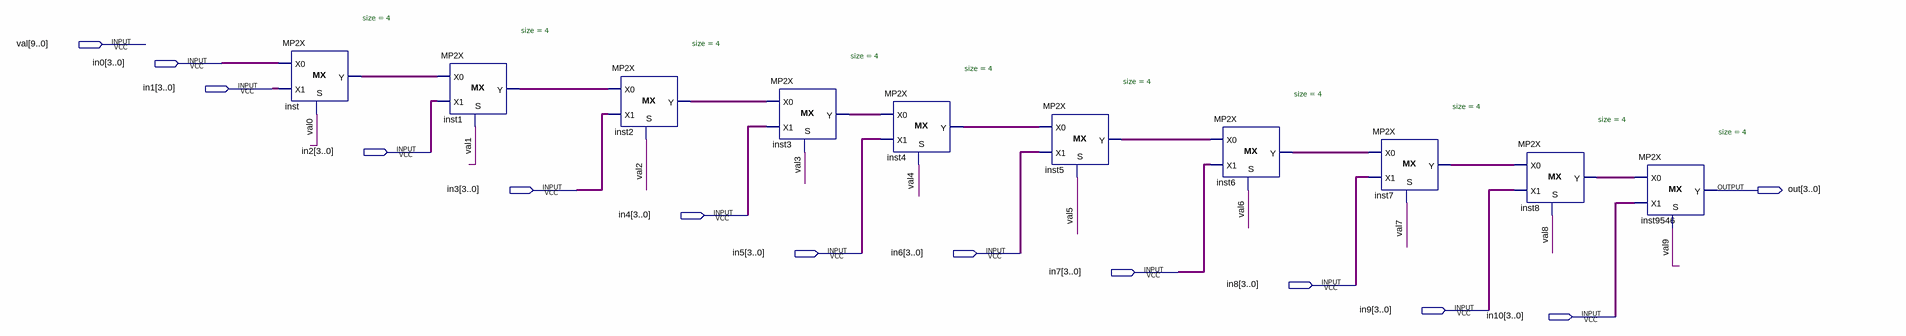
[diagram p0: schematic sheet]
// Quartus schematic MP11.bdf as structural Verilog: 10 symbols, 13 pins
module MP11 (
  input  [9:0] val,
  input  [3:0] in0,
  input  [3:0] in1,
  input  [3:0] in2,
  input  [3:0] in3,
  input  [3:0] in4,
  input  [3:0] in5,
  input  [3:0] in6,
  input  [3:0] in7,
  input  [3:0] in8,
  input  [3:0] in9,
  input  [3:0] in10,
  output [3:0] out
);

  wire [3:0] inst1_y, inst2_y, inst3_y, inst4_y, inst5_y, inst6_y, inst7_y, inst8_y, inst_y;

  MP2X #(.size(4)) inst (.S(val[0]), .X0(in0), .X1(in1), .Y(inst_y));
  MP2X #(.size(4)) inst1 (.S(val[1]), .X0(inst_y), .X1(in2), .Y(inst1_y));
  MP2X #(.size(4)) inst2 (.S(val[2]), .X0(inst1_y), .X1(in3), .Y(inst2_y));
  MP2X #(.size(4)) inst3 (.S(val[3]), .X0(inst2_y), .X1(in4), .Y(inst3_y));
  MP2X #(.size(4)) inst4 (.S(val[4]), .X0(inst3_y), .X1(in5), .Y(inst4_y));
  MP2X #(.size(4)) inst5 (.S(val[5]), .X0(inst4_y), .X1(in6), .Y(inst5_y));
  MP2X #(.size(4)) inst6 (.S(val[6]), .X0(inst5_y), .X1(in7), .Y(inst6_y));
  MP2X #(.size(4)) inst7 (.S(val[7]), .X0(inst6_y), .X1(in8), .Y(inst7_y));
  MP2X #(.size(4)) inst8 (.S(val[8]), .X0(inst7_y), .X1(in9), .Y(inst8_y));
  MP2X #(.size(4)) inst9546 (.S(val[9]), .X0(inst8_y), .X1(in10), .Y(out));
endmodule
